# EAGLE design electrophy_MCU (EAGLE 7.2.0)
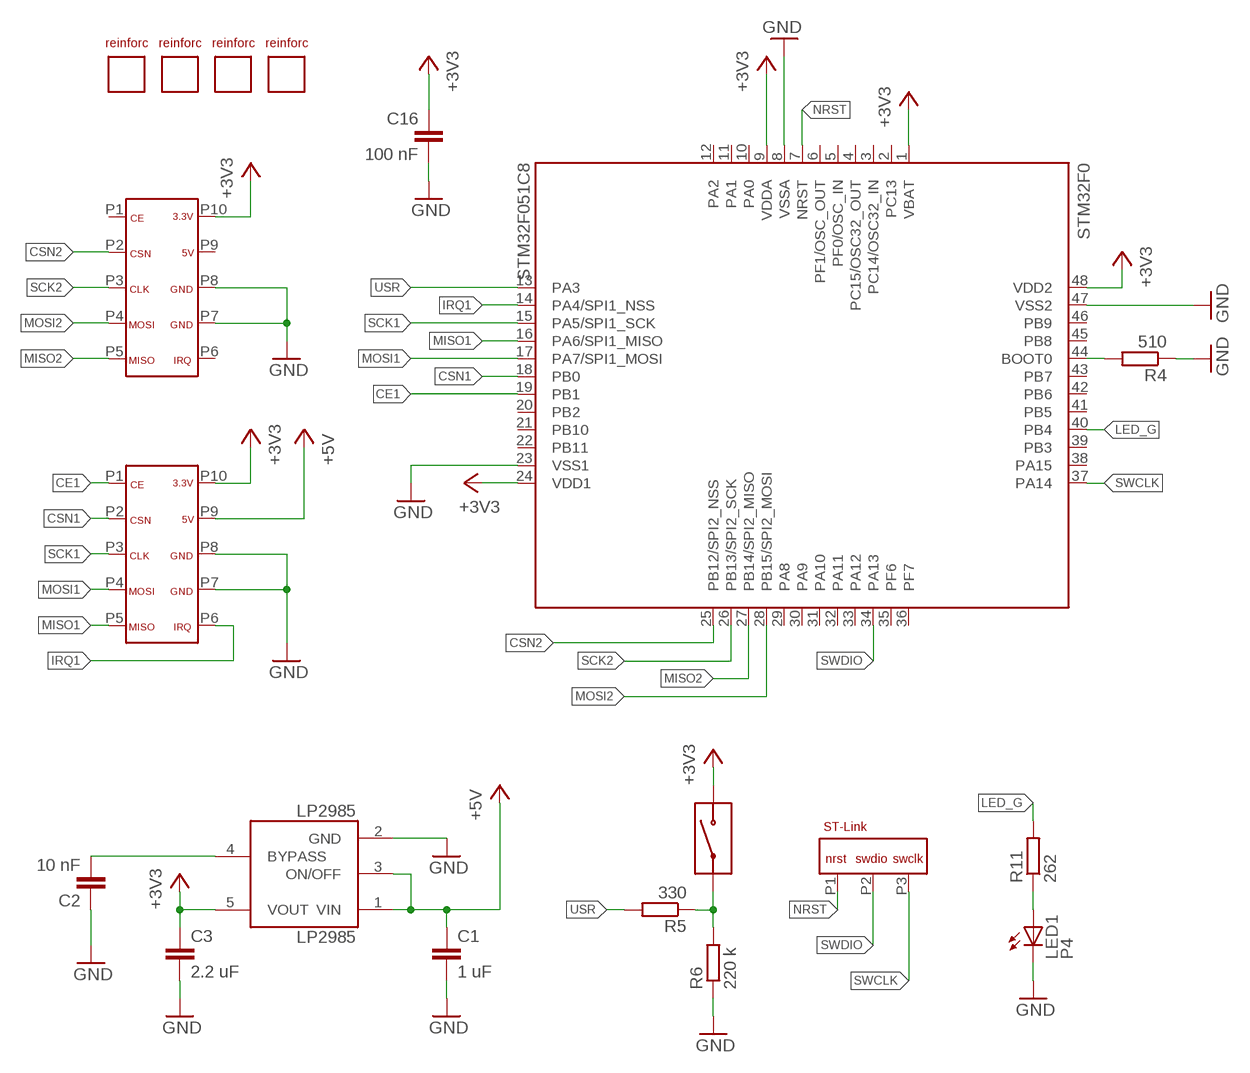
[diagram p0: schematic, sheet 1]

## Parts
C1  1 uF  C-EUC0603  [C0603]
C2  10 nF  C-EUC0603  [C0603]
C3  2.2 uF  C-EUC0603  [C0603]
C16  100 nF  C-EUC0603  [C0603]
LED1  P4  [CHIPLED_0603]
LP2985  LP2985AIM5-3.3  [SOT25]
R4  510  R-EU_R0603  [R0603]
R5  330  R-EU_R0603  [R0603]
R6  220 k  R-EU_R0603  [R0603]
R11  262  R-EU_R0603  [R0603]
STM32F0  STM32F051C8  [LQFP48-7X7]
U$1  DF12-10-FEMALE  [DF12-10-FEMALE]
U$2  PROGRAM_PIN  [PROGRAM_PIN]
U$3  DF12-10-MALE  [DF12-10-MALE]
U$4  TACTILE_BUTTON_THROUGH  [TACTILE_BUTTON_THROUGH]
U$5  REINFORCEMENT  [REINFORCEMENT]
U$6  REINFORCEMENT  [REINFORCEMENT]
U$7  REINFORCEMENT  [REINFORCEMENT]
U$8  REINFORCEMENT  [REINFORCEMENT]

## Nets
+3V3: C3.1 C16.1 LP2985.5(VOUT) STM32F0.1(VBAT) STM32F0.9(VDDA) STM32F0.24(VDD1) STM32F0.48(VDD2) U$1.P10 U$3.P10 U$4.P2
+5V: C1.1 LP2985.1(VIN) LP2985.3(ON/OFF) U$1.P9
BYPASS: C2.2 LP2985.4(BYPASS)
CE1: STM32F0.19(PB1) U$1.P1
CSN1: STM32F0.18(PB0) U$1.P2
CSN2: STM32F0.25(PB12/SPI2_NSS) U$3.P2
GND: C1.2 C2.1 C3.2 C16.2 LED1.C LP2985.2(GND) R4.1 R6.1 STM32F0.8(VSSA) STM32F0.23(VSS1) STM32F0.47(VSS2) U$1.P7 U$1.P8 U$3.P7 U$3.P8
IRQ1: STM32F0.14(PA4/SPI1_NSS) U$1.P6
LED_G: R11.2 STM32F0.40(PB4)
MISO1: STM32F0.16(PA6/SPI1_MISO) U$1.P5
MISO2: STM32F0.27(PB14/SPI2_MISO) U$3.P5
MOSI1: STM32F0.17(PA7/SPI1_MOSI) U$1.P4
MOSI2: STM32F0.28(PB15/SPI2_MOSI) U$3.P4
N$12: R5.1 R6.2 U$4.P1
N$13: R4.2 STM32F0.44(BOOT0)
N$14: LED1.A R11.1
NRST: STM32F0.7(NRST) U$2.P1
SCK1: STM32F0.15(PA5/SPI1_SCK) U$1.P3
SCK2: STM32F0.26(PB13/SPI2_SCK) U$3.P3
SWCLK: STM32F0.37(PA14) U$2.P3
SWDIO: STM32F0.34(PA13) U$2.P2
USR: R5.2 STM32F0.13(PA3)
Unconnected: STM32F0.2(PC13) STM32F0.3(PC14/OSC32_IN) STM32F0.4(PC15/OSC32_OUT) STM32F0.5(PF0/OSC_IN) STM32F0.6(PF1/OSC_OUT) STM32F0.10(PA0) STM32F0.11(PA1) STM32F0.12(PA2) STM32F0.20(PB2) STM32F0.21(PB10) STM32F0.22(PB11) STM32F0.29(PA8) STM32F0.30(PA9) STM32F0.31(PA10) STM32F0.32(PA11) STM32F0.33(PA12) STM32F0.35(PF6) STM32F0.36(PF7) STM32F0.38(PA15) STM32F0.39(PB3) STM32F0.41(PB5) STM32F0.42(PB6) STM32F0.43(PB7) STM32F0.45(PB8) STM32F0.46(PB9) U$3.P1 U$3.P6 U$3.P9 U$5.P$1 U$6.P$1 U$7.P$1 U$8.P$1

## Library data of the parts
C1-C3 C16 = resistor:C-EU: CAPACITOR, European symbol
LED1 = led:*P4: PointLED® Enhanced Thinfilm LED TOP & BOTTOM mount LS P47F, LR P47F, LA P47F, LY P47F, LT P4SG, LB P4SG, LW P4SG Source: http://catalog.osram-os.com .. LA_LR_LS_LY_P47F_Pb_free.pdf
LP2985 = LP2985:LP2985: LP2985-N Micropower 150 mA Low-Noise Ultra Low-Dropout Regulator
R4-R6 R11 = resistor:R-EU_: RESISTOR, European symbol
STM32F0 = STM32F051C8lqfp48:STM32F051C8: Entry-level ARM Cortex-M0 MCU with 64 Kbytes Flash, 48 MHz CPU, motor control and CEC functions Source: STM <http://www.st.com/web/catalog/mmc/FM141/SC1169/SS1574/LN7/PF251889>
U$1 = Hirose_DF12:DF12-10-FEMALE
U$2 = program_pin:PROGRAM_PIN
U$3 = Hirose_DF12:DF12-10-MALE
U$4 = tactile_button:TACTILE_BUTTON_THROUGH
U$5-U$8 = reinforcement:REINFORCEMENT

## Net classes
0 default: clearance 0.205 mm

## Board
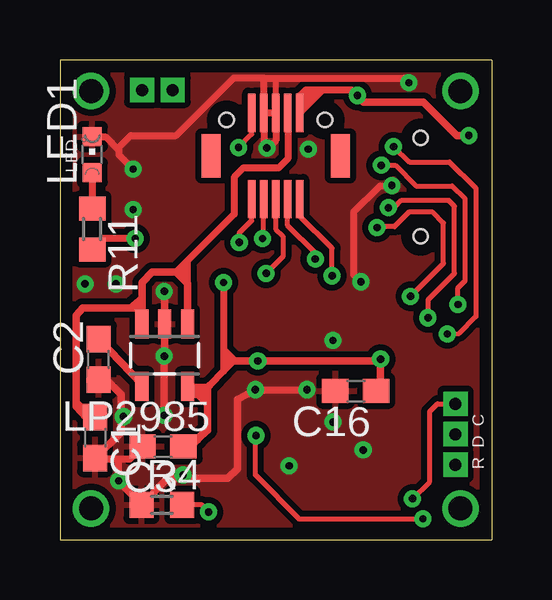
[diagram p1: board, top side]
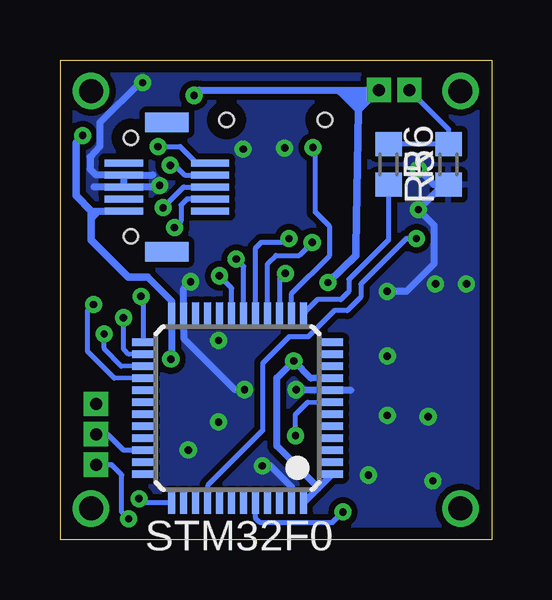
[diagram p2: board, bottom side, seen from below]

Size 18 x 20 mm. Coordinates in mm from the lower left corner, seen from the top.
Outline: 18,20 0,20 0,0 18,0 18,20
Copper layers (1*16): Top 0.035mm / dielectric 1.5mm / Bottom 0.035mm
Design rules "default *": minimum track width 8mil, minimum drill 12mil, track to track 8mil, track to pad 8mil, pad to pad 8mil, via to via 8mil, smd to smd 8mil, copper to edge 20mil, drill to drill 8mil, minimum pad ring 10mil, minimum via ring 8mil, stop-mask expansion 4mil, vias tented up to drill 12mil, thermal gap 10mil

### Footprints (pad centres in the part's own frame; a part is rotated, then mirrored left to right if it is on the bottom)
C0603 = smd 1.1 x 1: 1 -0.85,0; 2 0.85,0
CHIPLED_0603 = smd 0.8 x 0.8: A 0,-0.75; C 0,0.75
SOT25 = smd 0.55 x 1.2: 1 -0.95,-1.3; 2 0,-1.3; 3 0.95,-1.3; 4 0.95,1.3; 5 -0.95,1.3
R0603 = smd 1 x 1.1: 1 -0.85,0; 2 0.85,0
LQFP48-7X7 = smd 0.9 x 0.3: 1 -3.95,2.75; 2 -3.95,2.25; 3 -3.95,1.75; 4 -3.95,1.25; 5 -3.95,0.75; 6 -3.95,0.25; 7 -3.95,-0.25; 8 -3.95,-0.75; 9 -3.95,-1.25; 10 -3.95,-1.75; 11 -3.95,-2.25; 12 -3.95,-2.75; 25 3.95,-2.75; 26 3.95,-2.25; 27 3.95,-1.75; 28 3.95,-1.25; 29 3.95,-0.75; 30 3.95,-0.25; 31 3.95,0.25; 32 3.95,0.75; 33 3.95,1.25; 34 3.95,1.75; 35 3.95,2.25; 36 3.95,2.75 | smd 0.3 x 0.9: 13 -2.75,-3.95; 14 -2.25,-3.95; 15 -1.75,-3.95; 16 -1.25,-3.95; 17 -0.75,-3.95; 18 -0.25,-3.95; 19 0.25,-3.95; 20 0.75,-3.95; 21 1.25,-3.95; 22 1.75,-3.95; 23 2.25,-3.95; 24 2.75,-3.95; 37 2.75,3.95; 38 2.25,3.95; 39 1.75,3.95; 40 1.25,3.95; 41 0.75,3.95; 42 0.25,3.95; 43 -0.25,3.95; 44 -0.75,3.95; 45 -1.25,3.95; 46 -1.75,3.95; 47 -2.25,3.95; 48 -2.75,3.95
DF12-10-FEMALE = smd 0.8 x 1.8 bottom: HOLD1 2.7,0; HOLD2 -2.7,0 | smd 0.3 x 1.6 bottom: P1 -1,-1.8; P2 -0.5,-1.8; P3 0,-1.8; P4 0.5,-1.8; P5 1,-1.8; P6 1,1.8; P7 0.5,1.8; P8 0,1.8; P9 -0.5,1.8; P10 -1,1.8 | hole 0.6: -2.05,1.5; 2.05,1.5
PROGRAM_PIN = drill 0.5 square: P1 -1.27,0; P2 0,0; P3 1.27,0
DF12-10-MALE = smd 0.8 x 1.8: HOLD1 2.7,0; HOLD2 -2.7,0 | smd 0.3 x 1.6: P1 -1,-1.8; P2 -0.5,-1.8; P3 0,-1.8; P4 0.5,-1.8; P5 1,-1.8; P6 1,1.8; P7 0.5,1.8; P8 0,1.8; P9 -0.5,1.8; P10 -1,1.8 | hole 0.6: -2.05,1.5; 2.05,1.5
TACTILE_BUTTON_THROUGH = drill 0.5 square: P1 -1.27,0; P2 0,0
REINFORCEMENT = drill 1.016: P$1 0,0

### Placement (x,y rotation side)
C1  1.47,4.25 270 top
C2  1.62,7.51 90 top
C3  4.3,3.88 180 top
C16  12.34,6.2 180 top
LED1  1.35,16.05 0 top
LP2985  4.37,7.69 180 top
R4  4.25,1.45 0 top
R5  4.3,15.65 270 bottom
R6  1.8,15.65 90 bottom
R11  1.35,12.95 270 top
STM32F0  10.59,5.48 180 bottom
U$1  9,16 0 bottom
U$2  16.5,4.39 90 top
U$3  13.54,14.7 90 bottom
U$4  4.7,18.75 0 top
U$5  1.3,1.3 0 top
U$6  16.7,1.3 0 top
U$7  1.3,18.7 0 top
U$8  16.7,18.7 0 top

### Tracks (layer width: path | path; a pad name or v marks a point on that pad's centre or on a via)
+3V3  (via drill 0.3)
  Top 0.203: 5.14,3.56 C3.1 | 10,18 U$1.P10 10,18.25 | LP2985.5 5.36,6.35 | 13.3,7.45 arc90 v13.37,7.52
  Top 0.29: U$1.P10 10.95,18.75 | 10.95,18.75 12.13,18.75 12.15,18.73 v12.4,18.52 12.18,18.75 | 10.95,18.75 10.57,18.75 | 10.57,18.75 10.06,18.24 | 10.57,18.75 10.24,18.75 10.01,18.52 | 6.15,4.55 5.75,4.15 | 5.75,4.15 5.48,3.88 C3.1 | 6.15,6.06 5.47,6.06 arc90 5.46,6.04 5.74,6.04 6.1,5.69 | 5.75,4.15 5.75,4.22 6.1,4.57 | v6.83,10.72 6.83,7.44 | 6.83,7.44 6.83,7.03 6.24,6.44 | 7.25,7.45 6.83,7.45 6.83,7.44 | 7.31,7.45 7.25,7.45 6.71,6.91 | 7.37,7.45 7.31,7.45 | 7.31,7.45 6.83,7.92
  Top 0.305: 6.15,6.35 6.15,6.06 6.15,4.55 | v17.05,16.85 16.55,16.85 15.15,18.25 12.65,18.25 v12.4,18.52 | 5.36,6.35 6.15,6.35 | 6.15,6.35 6.24,6.44 | 7.25,7.45 7.37,7.45 v8.25,7.45 13.3,7.45 | v13.37,7.52 13.37,6.29 C16.1
  Bottom 0.203: 6.98,2.74 STM32F0.1 | 13.34,7.59 v13.37,7.52 | 5.65,12.05 5.65,12.18
  Bottom 0.254: 7.23,2.18 7.23,2.13
  Bottom 0.29: STM32F0.48 7.23,2.13 STM32F0.1 | STM32F0.9 7.53,6.73 v8.25,7.45 8.95,6.75 8.95,3.9 7.23,2.18 | 13.34,7.59 STM32F0.24 13.34,9.94 14.35,10.95 | 16.7,13.7 U$3.P10 | U$4.P2 5.55,17.9 6.33,18.68 6.33,18.72 6.07,18.47 5.08,18.47 5.31,18.24 5.79,18.24 | v12.4,18.52 12.19,18.74 4.72,18.74 | 16.7,13.39 16.43,13.69
  Bottom 0.305: v17.05,16.85 17.33,16.55 17.33,14.35 16.7,13.7 16.7,13.39 16.7,12.5 15.15,10.95 14.35,10.95 | 5.55,17.9 5.65,12.18 5.65,11.85 v6.83,10.72
+5V
  Top 0.203: 3.42,9.55 LP2985.3 | 1.47,5.23 C1.1 1.1,5.1
  Top 0.29: U$1.P9 9.5,15.88 9.12,15.49 7.64,15.49 7.26,15.11 7.26,13.56 4.85,11.15 | 5.32,10.68 5.33,10.69 5.33,11.62 5.16,11.45 5.16,11.07 | 3.42,10.06 2.92,9.65 | 0.68,5.75 0.68,5.73 1.02,5.4
  Top 0.305: LP2985.1 5.32,10.68 4.85,11.15 3.85,11.15 3.42,10.72 3.42,10.06 3.42,9.55 3.32,9.65 0.95,9.65 0.68,9.35 0.68,5.75 0.68,5.55 1.1,5.1
BYPASS
  Top 0.203: 3.42,6.46 LP2985.4
  Top 0.305: C2.2 3.42,6.46
CE1  (via drill 0.3)
  Top 0.203: v11.35,11 11.35,12.15 10,13.5 U$1.P1
  Bottom 0.203: STM32F0.19 10.84,10.49 v11.35,11
CSN1  (via drill 0.3)
  Top 0.203: v10.65,11.7 10.65,11.95 9.5,13.1 U$1.P2
  Bottom 0.203: STM32F0.18 10.34,11.39 v10.65,11.7
CSN2  (via drill 0.3)
  Top 0.203: v13.22,13.01 13.27,13.05 13.95,13.05 14.55,13.65 15.55,13.65 16,13.2 16,11.52 v14.62,10.14
  Bottom 0.203: U$3.P2 12.7,14.2 12.95,13.95 12.95,13.29 v13.22,13.01 | v14.62,10.14 14.54,10.06 STM32F0.25
GND  (via drill 0.3)
  Top 0.203: 1.67,3.36 C1.2 | C3.2 3.4,3.9 | C2.1 1.94,6.66 | 4.37,10.43 v4.35,10.35
  Top 0.254: U$1.P8 | U$1.P8 9,19.26
  Top 0.29: U$1.P7 U$1.P8 9,16.64 8.69,16.33 | 8.5,19.25 U$1.P7 | 8.5,19.25 14.35,19.25 v14.55,19.05 | 8.5,19.25 7.25,19.25 4.85,16.85 2.95,16.85 2.45,16.35 2.45,16.25 | v13.85,14.77 13.35,14.75 12.25,13.65 12.25,11.05 v12.55,10.75 | LED1.C 1.9,16.8 2.45,16.25 | 1.67,3.36 2.45,3.36 | 2.45,3.36 2.93,3.36 C3.2 | R4.1 2.45,2.4 v2.45,2.45 2.45,3.36 | U$1.P7 8.5,16.47 v8.64,16.33 | 2.45,16.25 2.45,16.05 v3.05,15.45 | v8.15,6.25 v10.3,6.25
  Top 0.305: R4.1 4.5,2.55 7,2.55 7.4,2.95 7.4,5.85 v8.15,6.25 | 4.35,5.15 4.35,7.75 4.37,8.03 LP2985.2 4.37,10.43 | 1.94,6.66 2.55,6.05 2.55,4.48 C1.2
  Bottom 0.203: 8.23,6.23 v8.15,6.25 | v14.55,19.05 14.65,19.05 | 2.4,11.5 2.35,11.55
  Bottom 0.29: 8.23,6.23 STM32F0.8 5.87,6.23 5.87,6.22 | 15.58,15.2 U$3.P7 U$3.P8 16.59,14.7 16.59,14.71 | 15.58,15.2 16.5,15.2 16.75,15.45 16.75,15.95 16.34,16.39 16.34,17.39 14.65,19.05 | v12.55,10.75 12.84,10.46 STM32F0.23 12.84,8.74 12.84,8.39 10.69,6.25 v10.3,6.25 | v4.35,10.35 3.55,10.35 2.4,11.5 2.4,13.11 v3.05,13.76 2.02,14.8 R6.1 | v13.85,14.77 13.89,14.7 15.03,14.7 | STM32F0.47 8.34,2.19 9.22,3.08 v9.56,3.08 | v3.05,15.45 2.4,14.8 R6.1 | R6.1 1.91,14.8 | 15.58,15.2 14.14,15.2 14.12,15.21
  other vias: 11.39,4.9 12.65,3.73 4.35,5.18 4.35,7.65 11.38,8.3 5.14,2.69 10.36,16.28 1.04,10.66 2.34,10.66 2.65,5.12
  pour Bottom (isolate 0.254): 0.15,19.85 17.85,19.85 17.85,0.15 0.15,0.15
  pour Top (isolate 0.254): 17.85,19.85 0.15,19.85 0.15,0.15 17.85,0.15
IRQ1  (via drill 0.3)
  Top 0.203: v7.45,16.35 8,16.9 U$1.P6
  Bottom 0.203: STM32F0.14 8.34,10.26 6.75,11.85 6.75,13.05 7.35,13.65 7.35,16.25 v7.45,16.35
LED_G  (via drill 0.3)
  Top 0.203: R11.2 1.4,12.15 arc-90 1.58,12.33
  Top 0.29: v3.13,12.55 1.8,12.55 R11.2
  Bottom 0.203: STM32F0.40 11.84,2.26 9.55,4.55 9.55,7.35 8.45,8.45 7.65,8.45 7.65,8.46 6.55,9.55 6.02,9.55 5.45,10.12 5.45,10.65 3.54,12.55 v3.13,12.55
MISO1  (via drill 0.3)
  Top 0.203: U$1.P5 8,13.3 7.48,12.78 v7.48,12.39
  Bottom 0.203: STM32F0.16 9.34,11.51 9,11.85 8.02,11.85 v7.48,12.39
MISO2  (via drill 0.3)
  Top 0.203: v16.15,8.58 16.65,8.6 17.35,9.3 17.35,14.65 16.25,15.75 14.57,15.75 v13.91,16.39
  Bottom 0.203: STM32F0.27 15.43,7.23 16.15,7.96 v16.15,8.58 | v13.91,16.39 12.99,16.39 12.35,15.75 11.8,15.75 U$3.P5
MOSI1  (via drill 0.3)
  Top 0.203: v8.45,12.55 8.5,12.65 U$1.P4
  Bottom 0.203: STM32F0.17 9.84,12.16 9.6,12.4 8.55,12.4 v8.45,12.55
MOSI2  (via drill 0.3)
  Top 0.203: v16.6,9.8 16.6,10.5 16.9,10.8 16.9,14.2 16.35,14.75 14.85,14.75 13.99,15.61 v13.4,15.61
  Bottom 0.203: STM32F0.28 15.73,6.73 16.85,7.85 16.85,9.55 v16.6,9.8 | v13.4,15.61 13.21,15.61 12.8,15.2 U$3.P4
N$12
  Bottom 0.203: R5.1 R6.2 1.8,17.12 U$4.P1
N$13  (via drill 0.3)
  Top 0.203: v6.2,1.15 5.9,1.45 R4.2
  Top 0.254: R4.2 5.5,1.45
  Bottom 0.203: v6.2,1.15 6.65,0.7 9.65,0.7 9.84,0.89 STM32F0.44
N$14
  Top 0.203: R11.1 1.25,13.8
  Top 0.29: LED1.A R11.1
NRST  (via drill 0.3)
  Top 0.203: v8.17,4.33 8.15,4.33 8.15,2.7 10,0.85 15.12,0.85 v15.14,0.86
  Bottom 0.203: STM32F0.7 7.67,5.73 8.17,5.22 v8.17,4.33 | v15.14,0.86 15.42,1.14 15.42,2.69 15.85,3.12 U$2.P1
SCK1  (via drill 0.3)
  Top 0.203: U$1.P3 9,12.95 9.3,12.65 9.3,11.8 v8.6,11.1
  Bottom 0.203: STM32F0.15 8.84,10.89 8.63,11.1 v8.6,11.1
SCK2  (via drill 0.3)
  Top 0.203: v15.35,9.25 15.35,10 16.45,11.1 16.45,13.9 16.2,14.15 14.25,14.15 13.94,13.84 v13.7,13.84
  Bottom 0.203: STM32F0.26 15.13,7.73 15.35,7.95 v15.35,9.25 | U$3.P3 12.84,14.7 v13.7,13.84
SWCLK  (via drill 0.3)
  Top 0.203: v14.71,1.7 15.42,2.41 15.42,5.33 15.75,5.66 U$2.P3
  Bottom 0.203: STM32F0.37 14.54,1.53 v14.71,1.7
SWDIO
  Bottom 0.203: STM32F0.34 15.35,3.73 16.01,4.39 U$2.P2
USR
  Bottom 0.203: R5.2 4.3,12.5 5.95,10.85 5.95,10.35 6.29,10.01 7.26,10.01 STM32F0.13 7.77,9.43

### Text on the board
tPlace: LED | R D C